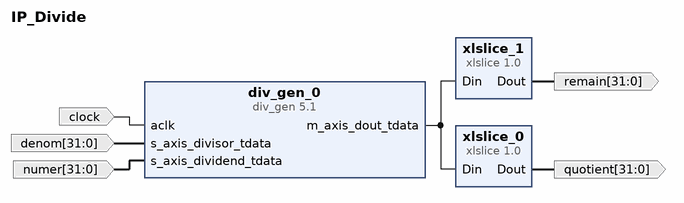
[diagram p0: block diagram of the top level]
# Vivado block design IP_Divide, xc7k325tffg676-1, Vivado 2021.2
create_bd_design IP_Divide

create_bd_port -dir I clock
create_bd_port -dir I -from 31 -to 0 numer
create_bd_port -dir I -from 31 -to 0 denom
create_bd_port -dir O -from 31 -to 0 quotient
create_bd_port -dir O -from 31 -to 0 remain

create_bd_cell -type ip -vlnv xilinx.com:ip:div_gen:5.1 div_gen_0
set_property -dict [list \
  CONFIG.FlowControl Blocking \
  CONFIG.dividend_and_quotient_width 32 \
  CONFIG.divisor_width 32 \
  CONFIG.fractional_width 32 \
  CONFIG.latency 15 \
  CONFIG.latency_configuration Manual \
  CONFIG.operand_sign Signed \
] [get_bd_cells div_gen_0]
create_bd_cell -type ip -vlnv xilinx.com:ip:xlslice:1.0 xlslice_0
set_property -dict {CONFIG.DIN_FROM 63 CONFIG.DIN_TO 32 CONFIG.DIN_WIDTH 64 CONFIG.DOUT_WIDTH 32} [get_bd_cells xlslice_0]
create_bd_cell -type ip -vlnv xilinx.com:ip:xlslice:1.0 xlslice_1
set_property -dict {CONFIG.DIN_FROM 31 CONFIG.DIN_WIDTH 64 CONFIG.DOUT_WIDTH 32} [get_bd_cells xlslice_1]

# ---- connections ----

connect_bd_net [get_bd_ports clock] [get_bd_pins div_gen_0/aclk]
connect_bd_net [get_bd_ports denom] [get_bd_pins div_gen_0/s_axis_divisor_tdata]
connect_bd_net [get_bd_pins div_gen_0/m_axis_dout_tdata] [get_bd_pins xlslice_0/Din] [get_bd_pins xlslice_1/Din]
connect_bd_net [get_bd_ports numer] [get_bd_pins div_gen_0/s_axis_dividend_tdata]
connect_bd_net [get_bd_pins xlslice_0/Dout] [get_bd_ports quotient]
connect_bd_net [get_bd_pins xlslice_1/Dout] [get_bd_ports remain]

validate_bd_design
save_bd_design
